# EasyEDA schematic SCH_tacho-meter_2025-08-12.json
TITLE: Sheet_1; REV: 1.0; Date: 2025-08-10; Sheet: 1/1; Company: Your Company
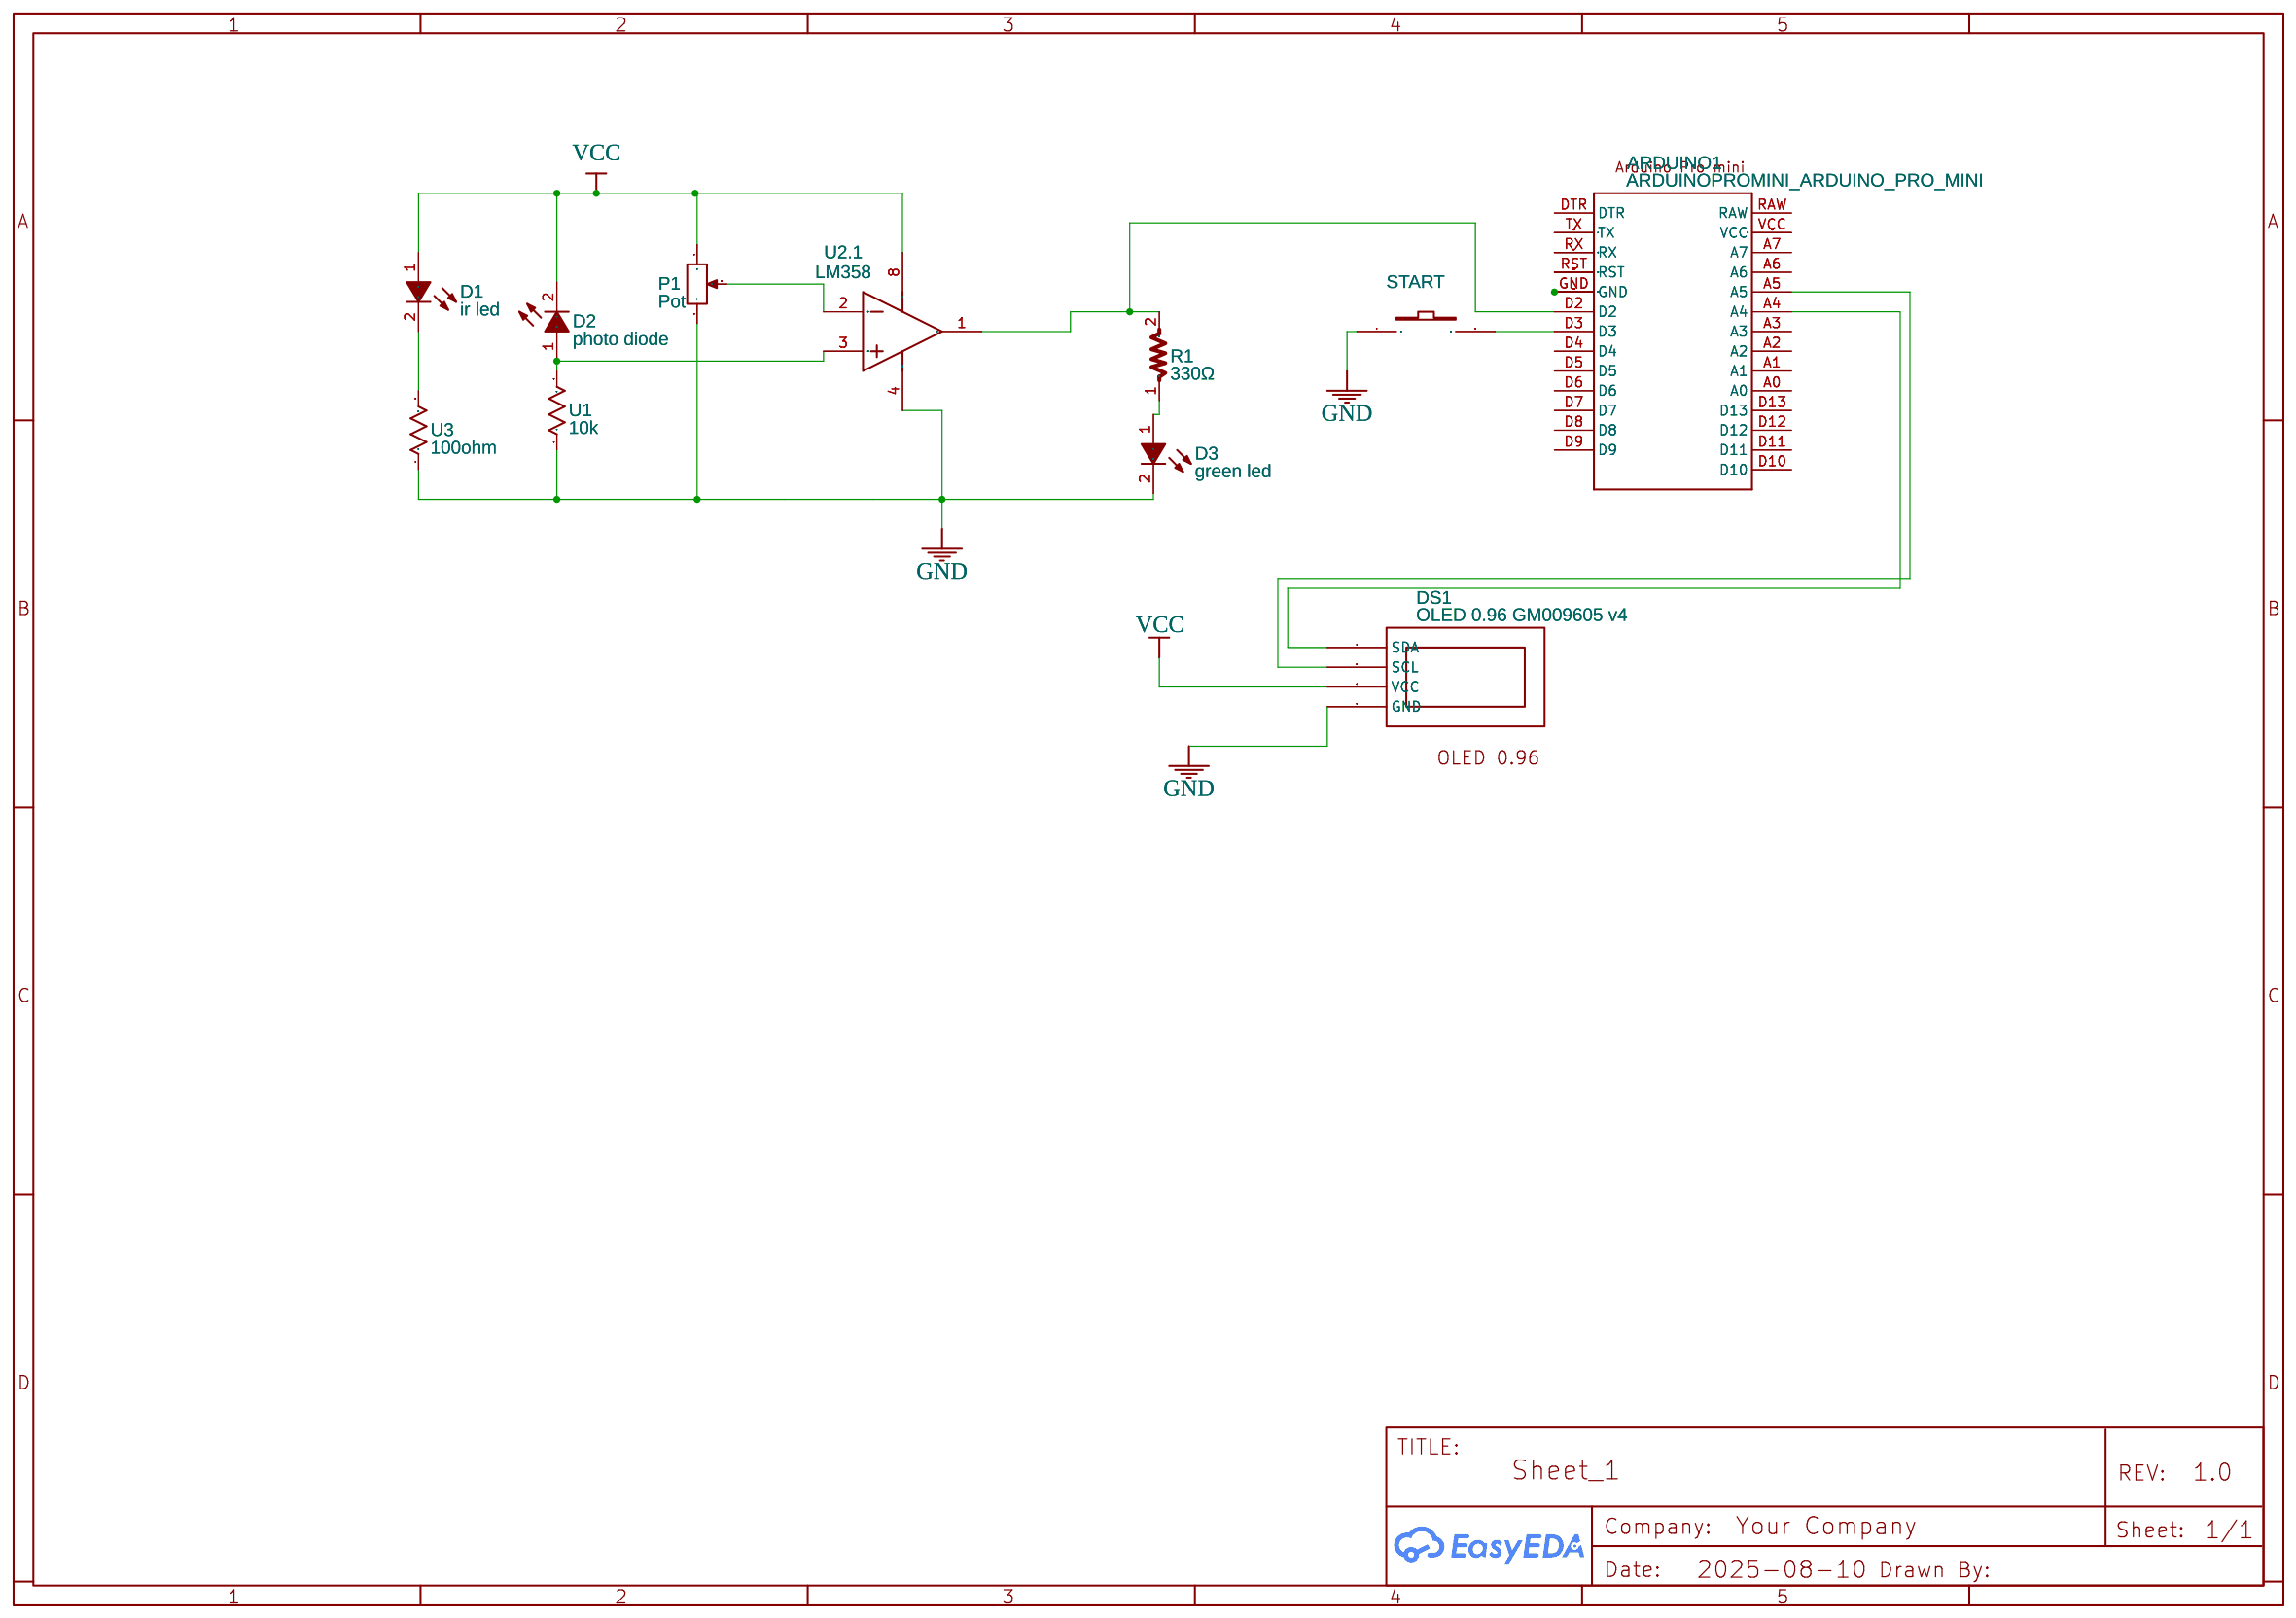
[diagram p0: schematic sheet]

## Parts
ARDUINO1  ARDUINOPROMINI_ARDUINO_PRO_MINI  [ARDUINOPROMINI_ARDUINO_PRO_MINI]
D1  ir led  [LED-TH_LED-DP2-2LED]
D2  photo diode  [LED-TH_LED-DP2-2LED]
D3  green led  [LED-TH_LED-DP2-2LED]
DS1  OLED 0.96 GM009605 v4  [OLED 0.96 GM009605 V4]
P1  Pot  [POTENTIOMETER BLUE]
R1  330Ω  [RES_330-0.25W]
START  Pushbutton-NO  [SPST-PUSHBUTTON-02]
U1  10k  [100OHM]
U2  LM358  [LM358 BOITIER]  (section 1)
U3  100ohm  [100OHM]

## Library data of the parts
ARDUINO1 = ARDUINOPROMINI_ARDUINO_PRO_MINI: Contributor: Nicolas Z.
D1-D3 = 3mm Green TH LED 5600: Supplier: Digi-Key; Manufacturer: VccLite; Manufacturer Part: 5600; Supplier Part: L20325-ND; link: https://vcclite.com/product/5602f5-5v/; Contributor: AlexKatsovich
DS1 = OLED 0.96 GM009605 v4: Contributor: farmer1949
P1 = Pot_blue: Supplier Part: C61836; Contributor: p243528; Convert to PCB: Yes; Add into BOM: Yes
R1 = RES_330-0.25W: Contributor: fraiminisergio; Supplier: LCSC; Supplier Part: C120069; Manufacturer: CCO(千志电子); Manufacturer Part: CF1/4W-680Ω±5% T; JLCPCB Part Class: Extended Part
START = Pushbutton-NO: Contributor: OpusTerra
U1 U3 = 100ohm: Contributor: mdavaadonoi
U2 = LM358: Supplier Part: C16416; Supplier: LCSC; Manufacturer: LM358MX/NOPB; Manufacturer Part: TI; subpart_no: 1; image: http://image.lceda.cn/szlcsc/C16416.jpg; JLCPCB Part Class: Extended Part; Contributor: AMINBORAK

## Nets
GND: D3.2(K) DS1.1(GND) P1.3(2) START.1 U1.1 U2.4(GND) U3.1
VCC: D1.1(A) D2.2(K) DS1.2(VCC) P1.1 U2.8(V+)
Net-(ARDUINO1-A4): ARDUINO1.A4 DS1.4(SDA)
Net-(ARDUINO1-A5): ARDUINO1.A5 DS1.3(SCL)
Net-(ARDUINO1-D2): ARDUINO1.D2 R1.2 U2.1(OUTA)
Net-(ARDUINO1-D3): ARDUINO1.D3 START.2
Net-(ARDUINO1-GND): ARDUINO1.GND ARDUINO1.GND@1(GND) ARDUINO1.GND@2(GND) ARDUINO1.GND@3(GND)
Net-(ARDUINO1-RST): ARDUINO1.RST ARDUINO1.RST@1(RST)
Net-(ARDUINO1-RX): ARDUINO1.RX ARDUINO1.RX@1(RX)
Net-(ARDUINO1-TX): ARDUINO1.TX ARDUINO1.TX@1(TX)
Net-(ARDUINO1-VCC): ARDUINO1.VCC ARDUINO1.VCC@1(VCC)
Net-(D1-2): D1.2(K) U3.2
Net-(D2-1): D2.1(A) U1.2 U2.3(INA+)
Net-(D3-1): D3.1(A) R1.1
Net-(P1-2): P1.2(3) U2.2(INA-)

Not connected (* = marked no-connect by the designer): ARDUINO1 A0 A1 A2 A3 A6 A7 D4 D5 D6 D7 D8 D9 D10 D11 D12 D13 DTR RAW
